# EAGLE design MSOP8TODIP8 (EAGLE 9.3.1)
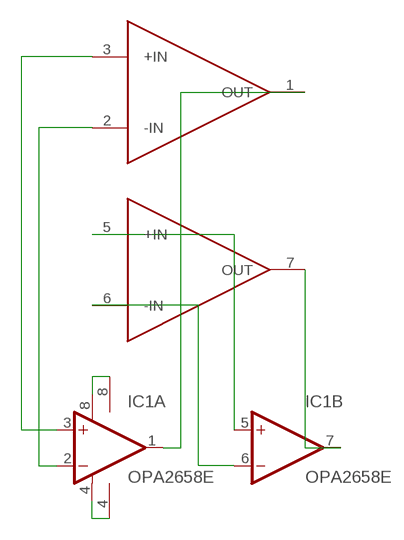
[diagram p0: schematic, sheet 1]

## Parts
IC1  OPA2658E  [MSOP08]
U$1  LME49720  [DIL08]

## Nets
N$1: IC1.3(A:+IN) U$1.3(+IN)
N$2: IC1.2(A:-IN) U$1.2(-IN)
N$3: IC1.5(B:+IN) U$1.5(+IN)
N$4: IC1.6(B:-IN) U$1.6(-IN)
N$5: IC1.7(B:OUT) U$1.7(OUT)
N$6: IC1.1(A:OUT) U$1.1(OUT)
N$7: IC1.8(A:V+) U$1.8(V+)
N$8: IC1.4(A:V-) U$1.4(V-)

## Library data of the parts
IC1 = burr-brown:OPA2658: Dual Wideband, Low Power, Current Feedback Operational Amplifier; OC_FARNELL: unknown; OC_NEWARK: unknown
U$1 = Vwvwbg:LME49720

## Board
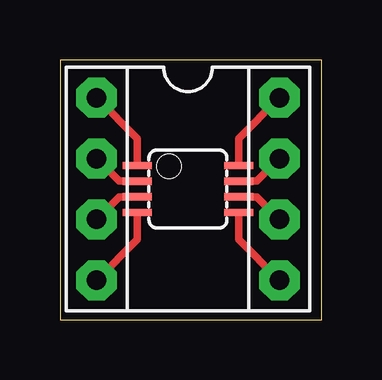
[diagram p1: board, top side]

Size 10.9 x 10.85 mm. Coordinates in mm from the lower left corner, seen from the top.
Outline: 0,0 10.9,0 10.9,10.85 0,10.85 0,0
Copper layers (1*16): Top 0.035mm / dielectric 1.5mm / Bottom 0.035mm
Design rules "default": minimum track width 6mil, minimum drill 0.35mm, track to track 6mil, track to pad 6mil, pad to pad 6mil, via to via 6mil, smd to smd 6mil, copper to edge 40mil, drill to drill 6mil, minimum pad ring 10mil, minimum via ring 8mil, stop-mask expansion 4mil, vias tented up to drill 0mil, thermal gap 10mil

### Footprints (pad centres in the part's own frame; a part is rotated, then mirrored left to right if it is on the bottom)
MSOP08 = smd 0.3 x 1.2: 1 -0.976,-2.113; 2 -0.326,-2.113; 3 0.324,-2.113; 4 0.974,-2.113; 5 0.974,2.112; 6 0.324,2.112; 7 -0.326,2.112; 8 -0.976,2.112
DIL08 = drill 0.813 pad 1.676 octagon: 1 -3.81,-3.81; 2 -1.27,-3.81; 3 1.27,-3.81; 4 3.81,-3.81; 5 3.81,3.81; 6 1.27,3.81; 7 -1.27,3.81; 8 -3.81,3.81

### Placement (x,y rotation side)
IC1  5.33,5.46 270 top
U$1  5.33,5.46 270 top

### Tracks (layer width: path | path; a pad name or v marks a point on that pad's centre or on a via)
N$1
  Top 0.305: IC1.3 2.47,5.14 U$1.3
N$2
  Top 0.305: IC1.2 2.47,5.79 U$1.2
N$3
  Top 0.305: IC1.5 7.45,3.35 U$1.5
N$4
  Top 0.305: IC1.6 8.2,5.14 U$1.6
N$5
  Top 0.305: IC1.7 8.2,5.79 U$1.7
N$6
  Top 0.305: IC1.1 3.22,7.57 U$1.1
N$7
  Top 0.305: IC1.8 7.45,7.57 U$1.8
N$8
  Top 0.305: IC1.4 3.22,3.35 U$1.4